# EAGLE design TSL2671 (EAGLE 6.4)
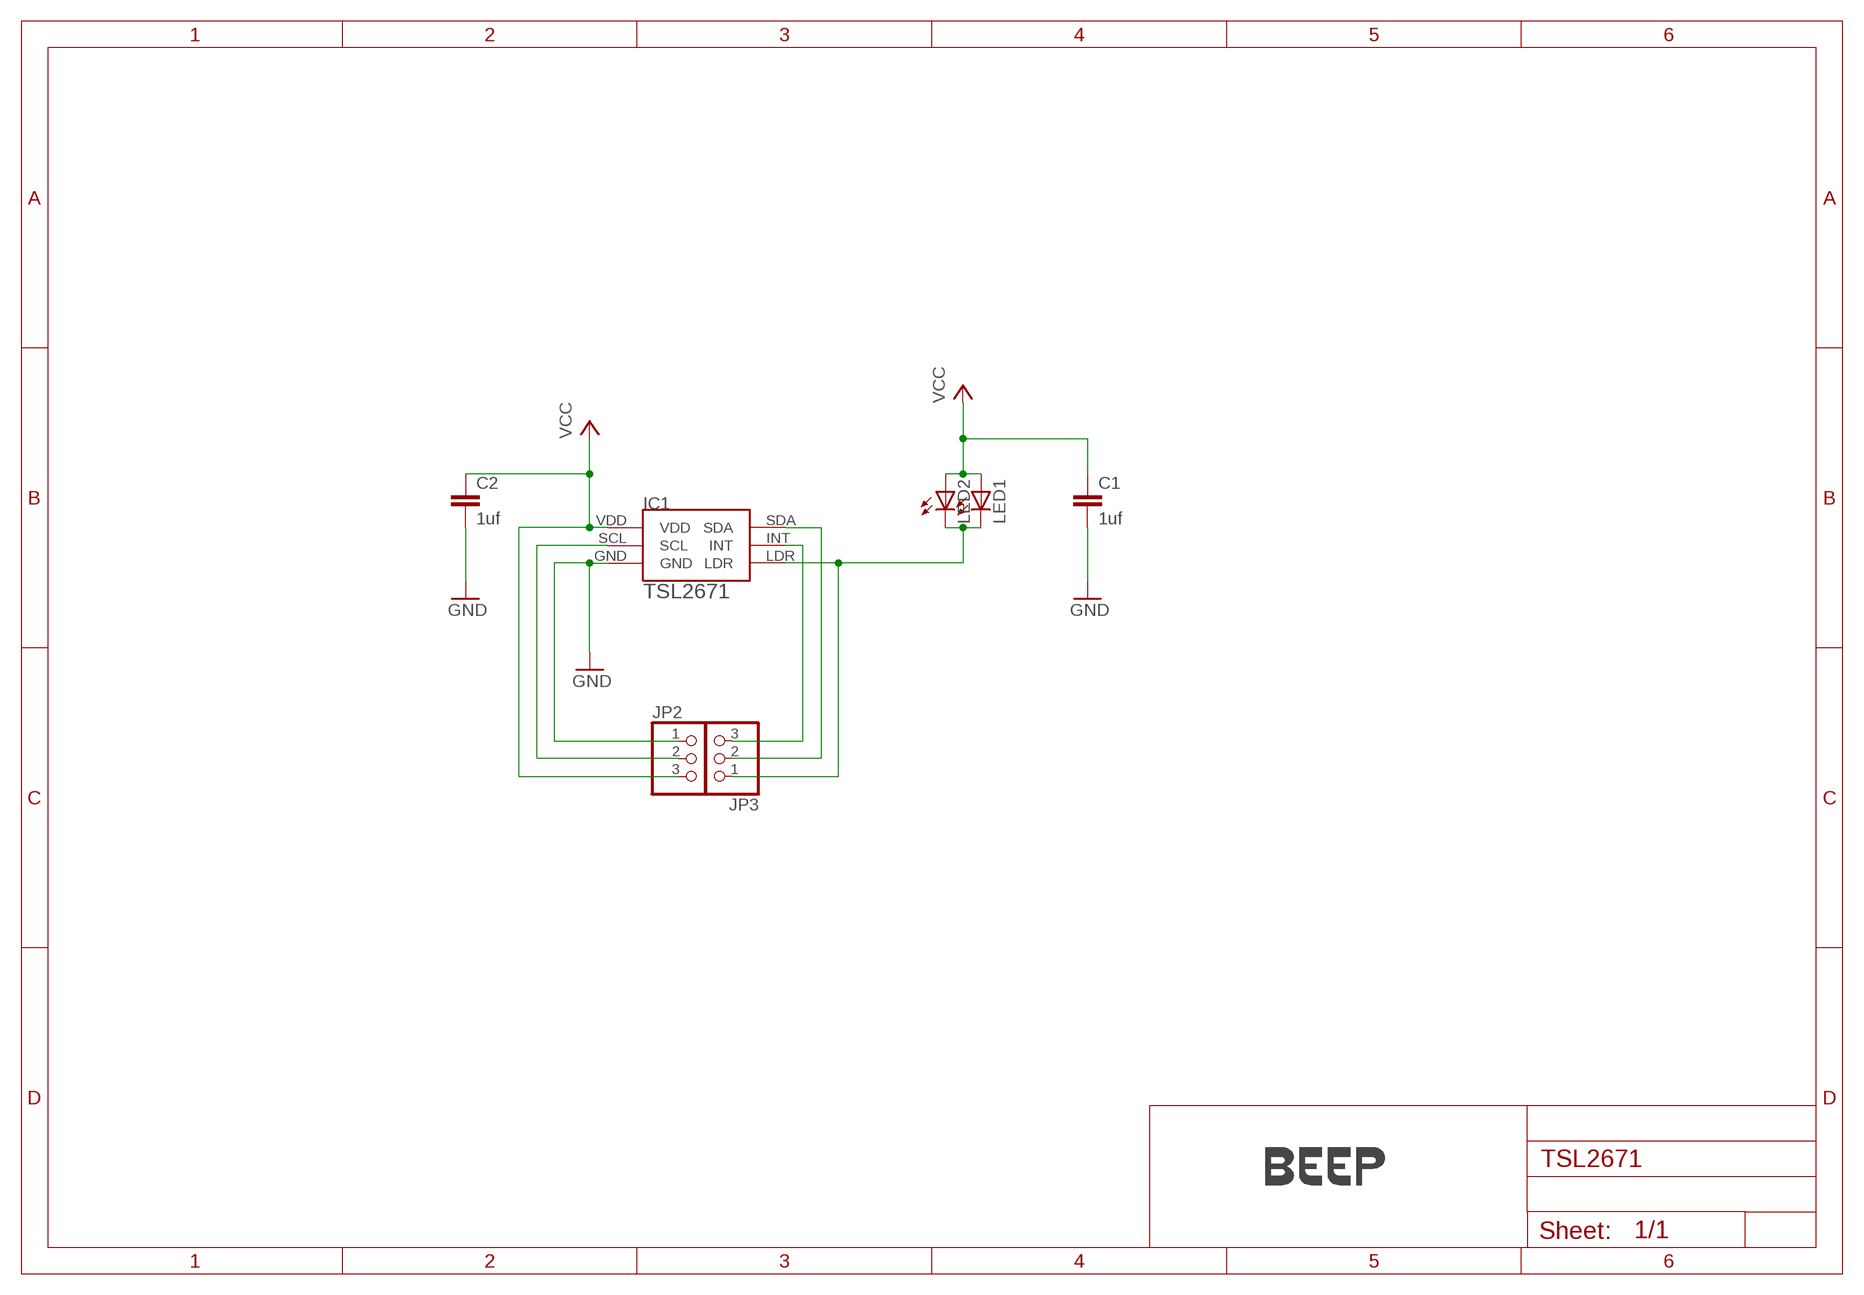
[diagram p0: schematic, sheet 1]

## Parts
C1  1uf  C-EU025-025X050  [C025-025X050]
C2  1uf  C-EUC0805K  [C0805K]
IC1  TSL2671  [TSL2671]
JP2  PINHD-1X3  [1X03]
JP3  PINHD-1X3  [1X03]
LED1  LED5MM  [LED5MM]
LED2  LEDCHIP-LED0805  [CHIP-LED0805]
U$1  LOGO-COPPER4  [COPPER4]

## Nets
GND: C1.2 C2.2 IC1.GND JP2.1
N$1: IC1.LDR JP3.1 LED1.K(C) LED2.C
N$2: IC1.SCL JP2.2
N$3: IC1.SDA JP3.2
N$4: IC1.INT JP3.3
VCC: C1.1 C2.1 IC1.VDD JP2.3 LED1.A LED2.A

## Library data of the parts
C1 C2 = rcl:C-EU: CAPACITOR, European symbol
IC1 = BEEP:TSL2671
JP2 JP3 = pinhead:PINHD-1X3: PIN HEADER
LED1 LED2 = led:LED: LED OSRAM: - CHIPLED LG R971, LG N971, LY N971, LG Q971, LY Q971, LO R971, LY R971 LH N974, LH R974 LS Q976, LO Q976, LY Q976 LO Q996 - Hyper CHIPLED LW Q18S LB Q993, LB Q99A, LB R99A - SideLED LS A670, LO A670, LY A670, LG A670, LP A670 LB A673, LV A673, LT A673, LW A673 LH A674 LY A675 LS A676, LA A676, LO A676, LY A676, LW A676 LS A679, LY A679, LG A679 - Hyper Micro SIDELED® LS Y876, LA Y876, LO Y876, LY Y876 LT Y87S - SmartLED LW L88C, LW L88S LB L89C, LB L89S, LG L890 LS L89K, LO L89K, LY L89K LS L896, LA L896, LO L896, LY L896 - TOPLED LS T670, LO T670, LY T670, LG T670, LP T670 LSG T670, LSP T670, LSY T670, LOP T670, LYG T670 LG T671, LOG T671, LSG T671 LB T673, LV T673, LT T673, LW T673 LH T674 LS T676, LA T676, LO T676, LY T676, LB T676, LH T676, LSB T676, LW T676 LB T67C, LV T67C, LT T67C, LS T67K, LO T67K, LY T67K, LW E67C LS E67B, LA E67B, LO E67B, LY E67B, LB E67C, LV E67C, LT E67C LW T67C LS T679, LY T679, LG T679 LS T770, LO T770, LY T770, LG T770, LP T770 LB T773, LV T773, LT T773, LW T773 LH T774 LS E675, LA E675, LY E675, LS T675 LS T776, LA T776, LO T776, LY T776, LB T776 LHGB T686 LT T68C, LB T68C - Hyper Mini TOPLED® LB M676 - Mini TOPLED Santana® LG M470 LS M47K, LO M47K, LY M47K Source: http://www.osram.convergy.de LUXEON: - LUMILED® LXK2-PW12-R00, LXK2-PW12-S00, LXK2-PW14-U00, LXK2-PW14-V00 LXK2-PM12-R00, LXK2-PM12-S00, LXK2-PM14-U00 LXK2-PE12-Q00, LXK2-PE12-R00, LXK2-PE12-S00, LXK2-PE14-T00, LXK2-PE14-U00 LXK2-PB12-K00, LXK2-PB12-L00, LXK2-PB12-M00, LXK2-PB14-N00, LXK2-PB14-P00, LXK2-PB14-Q00 LXK2-PR12-L00, LXK2-PR12-M00, LXK2-PR14-Q00, LXK2-PR14-R00 LXK2-PD12-Q00, LXK2-PD12-R00, LXK2-PD12-S00 LXK2-PH12-R00, LXK2-PH12-S00 LXK2-PL12-P00, LXK2-PL12-Q00, LXK2-PL12-R00 Source: www.luxeon.com KINGBRIGHT: KA-3528ASYC Source: www.kingbright.com
U$1 = Branding:LOGO-COPPER

## Board
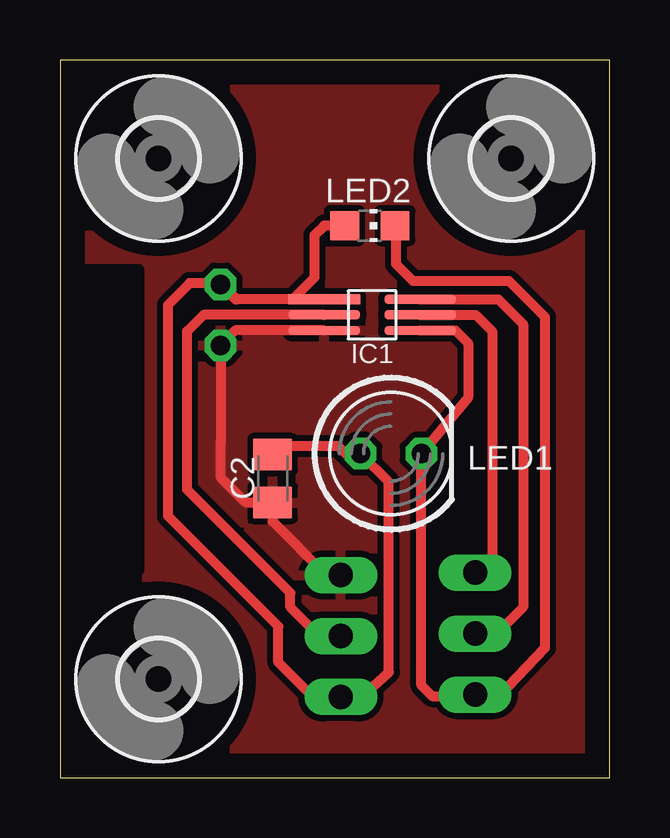
[diagram p1: board, top side]
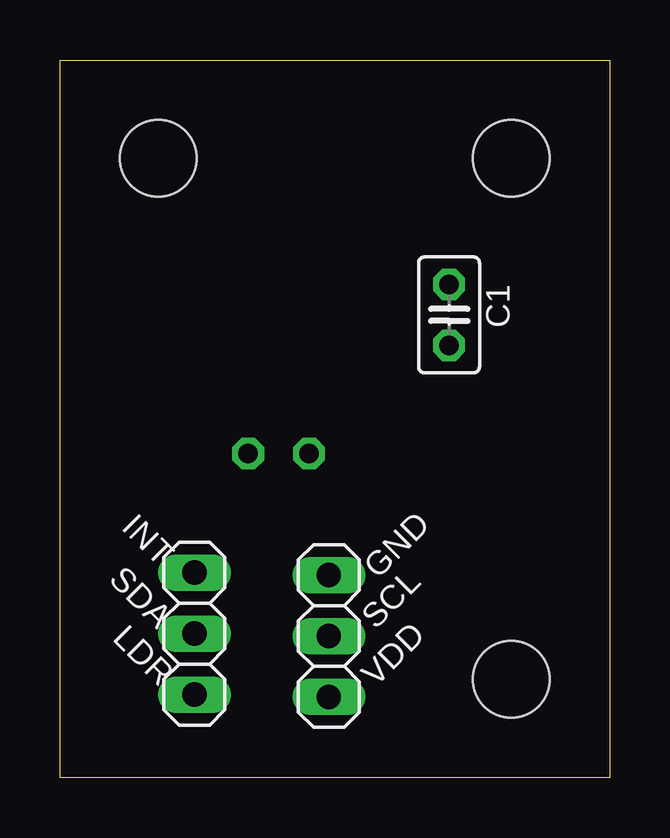
[diagram p2: board, bottom side, seen from below]

Size 22.9 x 29.9 mm. Coordinates in mm from the lower left corner, seen from the top.
Outline: 0,0 22.9,0 22.9,29.9 0,29.9 0,0
Copper layers (1*16): Top 0.035mm / dielectric 1.5mm / Bottom 0.035mm
Design rules "default *": minimum track width 10mil, minimum drill 24mil, track to track 10mil, track to pad 10mil, pad to pad 8mil, via to via 8mil, smd to smd 8mil, copper to edge 40mil, drill to drill 8mil, minimum pad ring 10mil, minimum via ring 8mil, stop-mask expansion 4mil, vias tented up to drill 0mil, thermal gap 10mil
tRestrict: area 0,8.6 to 3.3,21.2

### Footprints (pad centres in the part's own frame; a part is rotated, then mirrored left to right if it is on the bottom)
C025-025X050 = drill 0.813 octagon: 1 -1.27,0; 2 1.27,0
C0805K = smd 1.3 x 1.6: 1 -1,0; 2 1,0
TSL2671 = smd 3 x 0.4: GND -2,-0.65; INT 2,0; LDR 2,-0.65; SCL -2,0; SDA 2,0.65; VDD -2,0.65
1X03 = drill 1.016 long: 1 -2.54,0; 2 0,0; 3 2.54,0
LED5MM = drill 0.813 octagon: A -1.27,0; K 1.27,0
CHIP-LED0805 = smd 1.2 x 1.2: A 0,-1.05; C 0,1.05
3,2 = hole 3.2: 0,0

### Placement (x,y rotation side)
C1  6.69,19.28 270 bottom
C2  8.86,12.46 270 top
IC1  13.01,19.28 0 top
JP2  11.7,5.9 270 bottom
JP3  17.3,6 90 bottom
LED1  13.79,13.5 0 top
LED2  12.91,23 270 top
U$1  3,8.6 90 top
U$2  [3,2]  4.1,4.1 0 top
U$3  [3,2]  4.1,25.8 0 top
U$4  [3,2]  18.8,25.8 0 top

### Tracks (layer width: path | path; a pad name or v marks a point on that pad's centre or on a via)
GND
  Top 0.406: IC1.GND 7.31,18.63 C1.2 6.69,13.98 6.7,13.97 6.7,12.5 7.74,11.46 C2.2 8.86,10.68 11.1,8.44 JP2.1
  pour Top: 0,0 22.9,0 22.9,29.9 0,29.9
N$1
  Top 0.406: IC1.LDR 16.47,18.63 17,18.1 17,15.84 LED1.K 15.06,3.84 15.5,3.4 16.76,3.4 JP3.1 16.84,3.4 18.3,3.4 20.2,5.4 20.2,19.2 18.7,20.7 14.7,20.7 14,21.4 14,23.16 LED2.C
N$2
  Top 0.406: IC1.SCL 5.98,19.28 5.3,18.6 5.3,12 9.6,7.7 9.6,7.1 10.8,5.9 JP2.2
N$3
  Top 0.406: IC1.SDA 18.27,19.93 19.3,18.9 19.3,7.1 18.2,6 JP3.2
N$4
  Top 0.406: IC1.INT 17.32,19.28 18,18.6 18,9.24 JP3.3
VCC
  Top 0.406: IC1.VDD 9.7,19.93 | 7.37,19.93 7.31,19.93 C1.1 | LED2.A 11,23 10.6,22.6 10.6,20.83 9.7,19.93 | 9.7,19.93 7.37,19.93 | 7.37,19.93 6.7,20.6 5.4,20.6 4.5,19.7 4.5,10.9 9.1,6.3 9.1,4.8 10.5,3.4 11.06,3.4 JP2.3 11.14,3.4 12.6,3.4 13.7,4.4 13.7,12.32 LED1.A 11.9,13.5 11.6,13.8 9.55,13.8 C2.1

### Text on the board
bNames: GND | INT | SCL | SDA | VDD | LDR
tCName: TSL2671 / v0.1.1